# Altium schematic sheet Power_wiring.SchDoc
size A4
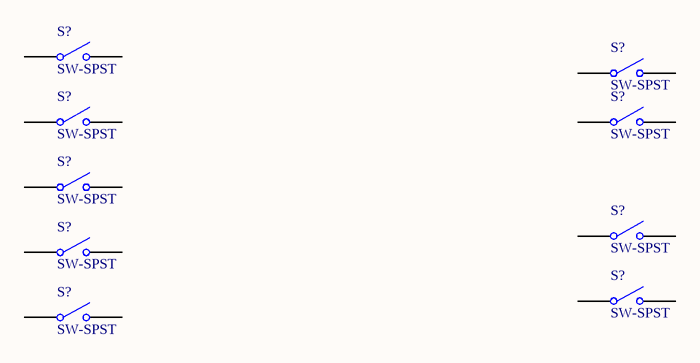
[diagram p0: Power_wiring.SchDoc]

## Parts
(Parts that share a designator on the sheet are numbered #1, #2 ... from top to bottom, then left to right.)
S?#1  SW-SPST  [SPST-2]
S?#2  SW-SPST  [SPST-2]
S?#3  SW-SPST  [SPST-2]
S?#4  SW-SPST  [SPST-2]
S?#5  SW-SPST  [SPST-2]
S?#6  SW-SPST  [SPST-2]
S?#7  SW-SPST  [SPST-2]
S?#8  SW-SPST  [SPST-2]
S?#9  SW-SPST  [SPST-2]

## Nets

Not connected (* = marked no-connect by the designer): S?#1 1(COMMON) 2(NO); S?#2 1(COMMON) 2(NO); S?#3 1(COMMON) 2(NO); S?#4 1(COMMON) 2(NO); S?#5 1(COMMON) 2(NO); S?#6 1(COMMON) 2(NO); S?#7 1(COMMON) 2(NO); S?#8 1(COMMON) 2(NO); S?#9 1(COMMON) 2(NO)

## Library data of the parts
S?#1-S?#9 = SW-SPST: Single-Pole, Single-Throw Switch; Published: 24-Mar-1999; LatestRevisionDate: 17-Jul-2002; LatestRevisionNote: Re-released for DXP Platform.; PackageReference: SPST-2; Publisher: Altium Limited; PackageDescription: Switch; 2 Leads